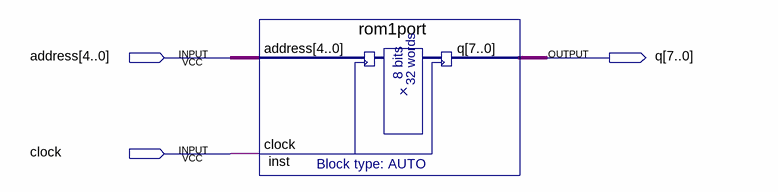
[diagram p0: schematic sheet]
// Quartus schematic lab15_part2.bdf as structural Verilog: 1 symbols, 3 pins
module lab15_part2 (
  input  [4:0] address,
  input  clock,
  output [7:0] q
);

  rom1port inst (.address(address), .clock(clock), .q(q));
endmodule
